# EAGLE design OOBD - BTM182 - V4 (EAGLE 5.11)
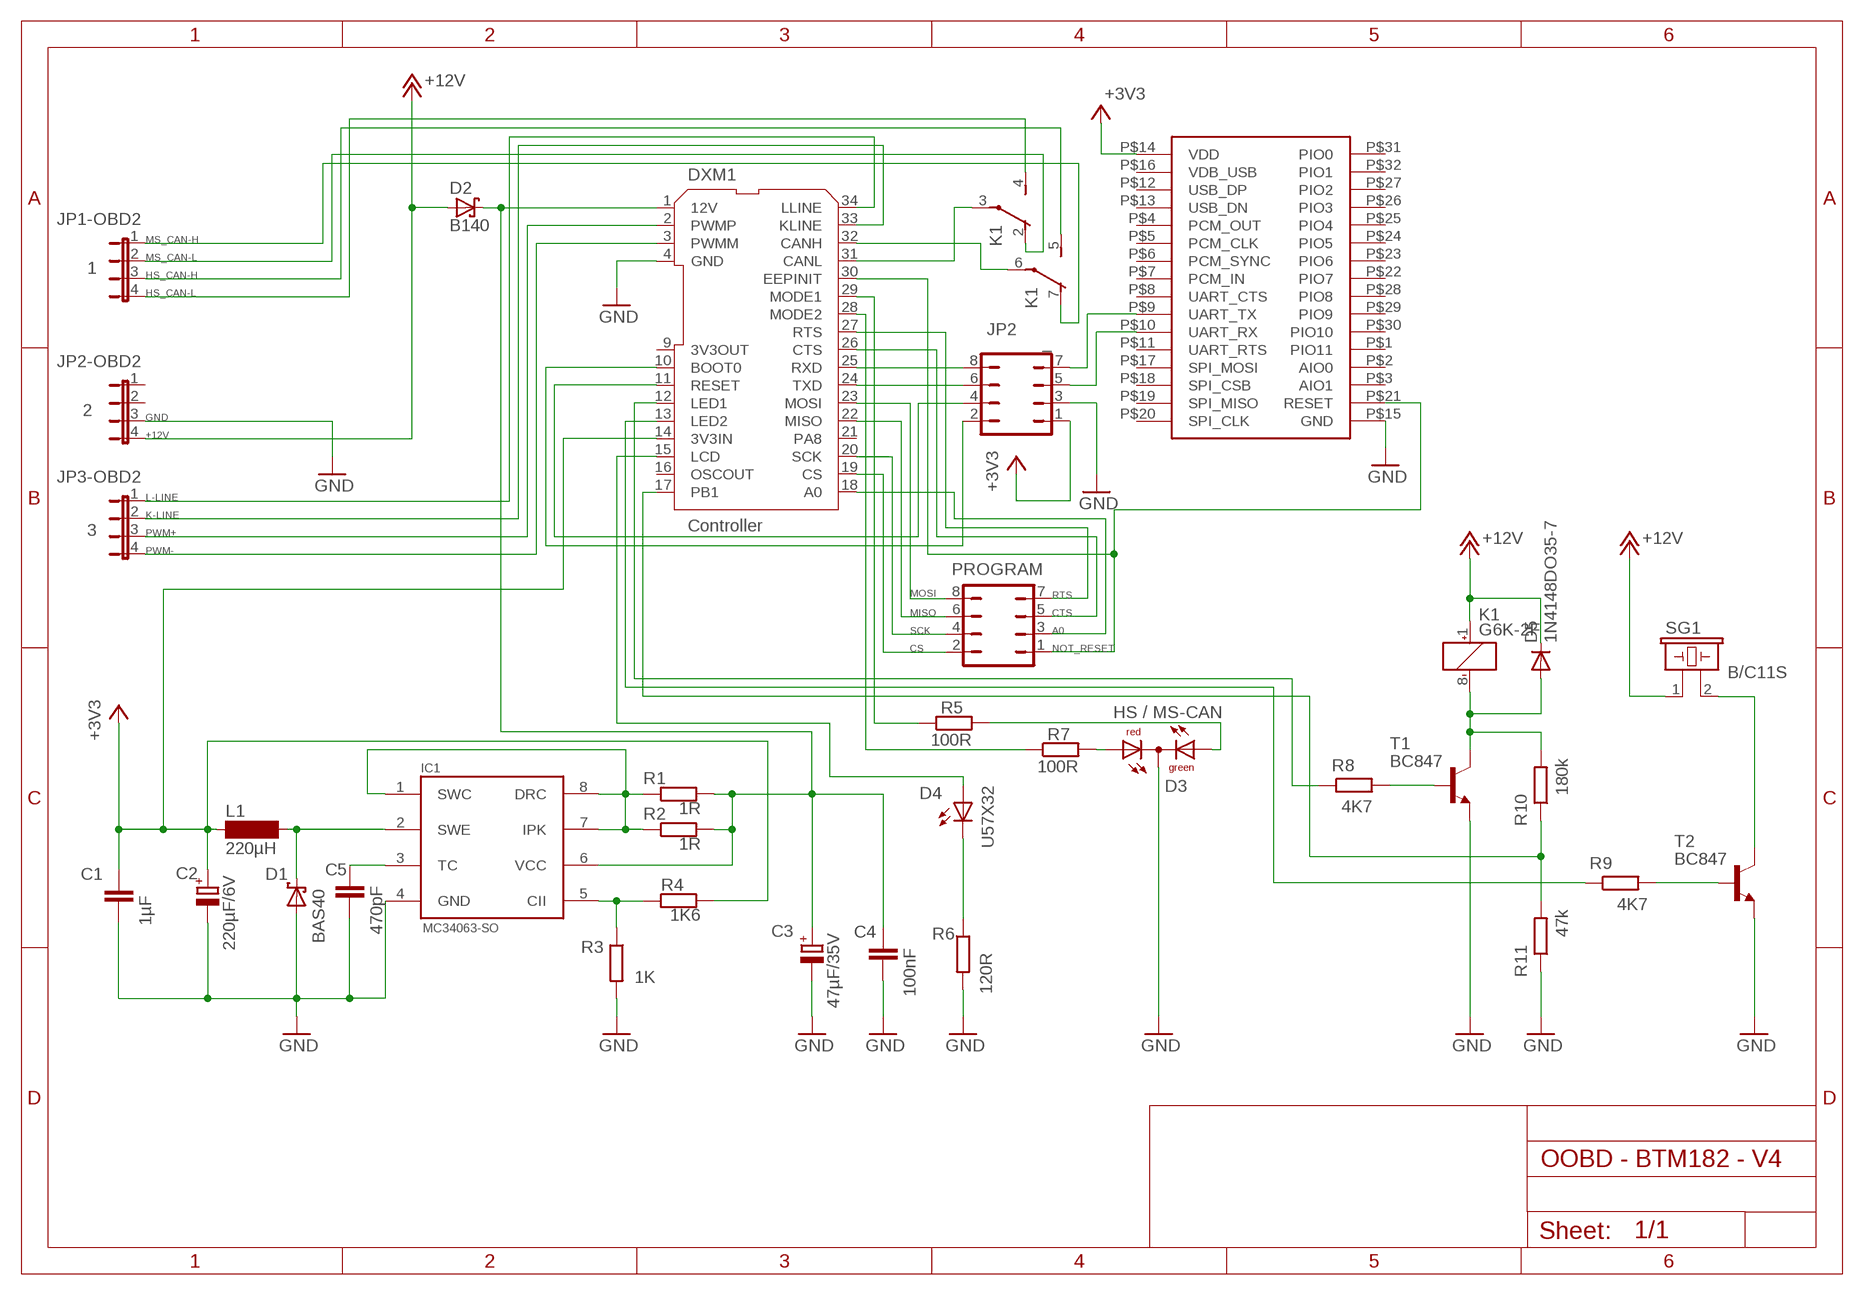
[diagram p0: schematic, sheet 1]

## Parts
BTM182  BT  BTM182  [BTM182]
C1  1µF  C-EUC0603  [C0603]
C2  220µF/6V  CPOL-EUA/3216-18R  [A/3216-18R]
C3  47µF/35V  CPOL-EUA/3216-18R  [A/3216-18R]
C4  100nF  C-EUC0603  [C0603]
C5  470pF  C-EUC0603  [C0603]
D1  BAS40  [SOT23]
D2  B140  SCHOTTKY-DIODESMD  [SMB]
D3  HS / MS-CAN  DUOLED2X5  [DUOLED2X5]
D4  U57X32  LEDSQR5.7X3.2  [U57X32]
D5  1N4148DO35-7  DIODE-MICROMELF-R  [MICROMELF-R]
DXM1  Controller  DXM1-MINI  [DMX1-MINI]
IC1  MC34063-SO  [SO8]
JP1-OBD2  1  JP4E  [JP4]
JP2  _  JP4Q  [JP4Q]
JP2-OBD2  2  JP4E  [JP4]
JP3-OBD2  3  JP4E  [JP4]
K1  G6K-2F  [G6K-2F]
L1  220µH  SM-NE29  [SM-NE29]
PROGRAM  JP4Q  [JP4Q]
R1  1R  R-EU_R0603  [R0603]
R2  1R  R-EU_R0603  [R0603]
R3  1K  R-EU_R0603  [R0603]
R4  1K6  R-EU_R0603  [R0603]
R5  100R  R-EU_R0603  [R0603]
R6  120R  R-EU_R0603  [R0603]
R7  100R  R-EU_R0603  [R0603]
R8  4K7  R-EU_R0603  [R0603]
R9  4K7  R-EU_R0603  [R0603]
R10  180k  R-EU_R0603  [R0603]
R11  47k  R-EU_R0603  [R0603]
SG1  B/C11S  [B/C11S]
T1  BC847  [SOT23]
T2  BC847  [SOT23]

## Nets
+3V3: BTM182.P$14(VDD) C1.1 C2.+ DXM1.14(3V3IN) JP2.1 L1.1 R4.2
+12V: D2.A D5.C JP2-OBD2.4 K1.1(1:+) SG1.1
A0: DXM1.18(A0) PROGRAM.3
CS: DXM1.19(CS) PROGRAM.2
CTS: DXM1.26(CTS) PROGRAM.5
GND: BTM182.P$15(GND) C1.2 C2.- C3.- C4.2 C5.2 D1.1(A) D3.K(C) DXM1.4(GND) IC1.4(GND) JP2-OBD2.3 JP2.3 R3.2 R6.2 R11.1 T1.2(E) T2.2(E)
HS_CAN-H: JP1-OBD2.3 K1.5(3:S)
HS_CAN-L: JP1-OBD2.4 K1.4(2:S)
K-LINE: DXM1.33(KLINE) JP3-OBD2.2
L-LINE: DXM1.34(LLINE) JP3-OBD2.1
MISO: DXM1.22(MISO) PROGRAM.6
MOSI: DXM1.23(MOSI) PROGRAM.8
MS_CAN-H: JP1-OBD2.1 K1.7(3:O)
MS_CAN-L: JP1-OBD2.2 K1.2(2:O)
N$1: IC1.5(CII) R3.1 R4.1
N$2: C5.1 IC1.3(TC)
N$3: D1.3(C) IC1.2(SWE) L1.2
N$4: D3.AR R7.2
N$5: IC1.1(SWC) IC1.7(IPK) IC1.8(DRC) R1.1 R2.1
N$6: D3.AG R5.2
N$7: D4.K(C) R6.1
N$8: D4.A DXM1.15(LCD)
N$9: DXM1.29(MODE1) R5.1
N$10: DXM1.25(RXD) JP2.8
N$11: C3.+ C4.1 D2.C DXM1.1(12V) IC1.6(VCC) R1.2 R2.2
N$12: DXM1.24(TXD) JP2.6
N$13: BTM182.P$10(UART_RX) JP2.5
N$14: BTM182.P$9(UART_TX) JP2.7
N$15: DXM1.28(MODE2) R7.1
N$16: DXM1.10(BOOT0) JP2.2
N$17: DXM1.11(RESET) JP2.4
N$19: DXM1.17(PB1) R10.1 R11.2
N$20: R8.2 T1.1(B)
N$21: DXM1.32(CANH) K1.6(3:P)
N$22: DXM1.31(CANL) K1.3(2:P)
N$23: SG1.2 T2.3(C)
N$24: R9.2 T2.1(B)
N$25: DXM1.12(LED1) R8.1
N$26: DXM1.13(LED2) R9.1
N$27: D5.A K1.8(1:-) R10.2 T1.3(C)
NOT_RESET: BTM182.P$21(RESET) DXM1.30(EEPINIT) PROGRAM.1
PWM+: DXM1.2(PWMP) JP3-OBD2.3
PWM-: DXM1.3(PWMM) JP3-OBD2.4
RTS: DXM1.27(RTS) PROGRAM.7
SCK: DXM1.20(SCK) PROGRAM.4
Unconnected: BTM182.P$1(PIO11) BTM182.P$2(AIO0) BTM182.P$3(AIO1) BTM182.P$4(PCM_OUT) BTM182.P$5(PCM_CLK) BTM182.P$6(PCM_SYNC) BTM182.P$7(PCM_IN) BTM182.P$8(UART_CTS) BTM182.P$11(UART_RTS) BTM182.P$12(USB_DP) BTM182.P$13(USB_DN) BTM182.P$16(VDB_USB) BTM182.P$17(SPI_MOSI) BTM182.P$18(SPI_CSB) BTM182.P$19(SPI_MISO) BTM182.P$20(SPI_CLK) BTM182.P$22(PIO7) BTM182.P$23(PIO6) BTM182.P$24(PIO5) BTM182.P$25(PIO4) BTM182.P$26(PIO3) BTM182.P$27(PIO2) BTM182.P$28(PIO8) BTM182.P$29(PIO9) BTM182.P$30(PIO10) BTM182.P$31(PIO0) BTM182.P$32(PIO1) DXM1.16(OSCOUT) DXM1.21(PA8) JP2-OBD2.1 JP2-OBD2.2

## Power pins joined to a net without a drawn wire
3V3OUT: DXM1.9(3V3OUT)

## Library data of the parts
BTM182 = BTM182:BTM182
C1 C4 C5 = rcl:C-EU: CAPACITOR, European symbol
C2 C3 = rcl:CPOL-EU: POLARIZED CAPACITOR, European symbol
D1 = diode:BAS40: Silicon Schottky Diodes General-purpose diode for high-speed switching
D2 = diode:SCHOTTKY-DIODE: Schottky Diode
D3 = led:DUOLED2X5: DUO LED 2 colors, 2.5 x 5 mm, recangle
D4 = led:LED: LED OSRAM: - CHIPLED LG R971, LG N971, LY N971, LG Q971, LY Q971, LO R971, LY R971 LH N974, LH R974 LS Q976, LO Q976, LY Q976 LO Q996 - Hyper CHIPLED LW Q18S LB Q993, LB Q99A, LB R99A - SideLED LS A670, LO A670, LY A670, LG A670, LP A670 LB A673, LV A673, LT A673, LW A673 LH A674 LY A675 LS A676, LA A676, LO A676, LY A676, LW A676 LS A679, LY A679, LG A679 - Hyper Micro SIDELED® LS Y876, LA Y876, LO Y876, LY Y876 LT Y87S - SmartLED LW L88C, LW L88S LB L89C, LB L89S, LG L890 LS L89K, LO L89K, LY L89K LS L896, LA L896, LO L896, LY L896 - TOPLED LS T670, LO T670, LY T670, LG T670, LP T670 LSG T670, LSP T670, LSY T670, LOP T670, LYG T670 LG T671, LOG T671, LSG T671 LB T673, LV T673, LT T673, LW T673 LH T674 LS T676, LA T676, LO T676, LY T676, LB T676, LH T676, LSB T676, LW T676 LB T67C, LV T67C, LT T67C, LS T67K, LO T67K, LY T67K, LW E67C LS E67B, LA E67B, LO E67B, LY E67B, LB E67C, LV E67C, LT E67C LW T67C LS T679, LY T679, LG T679 LS T770, LO T770, LY T770, LG T770, LP T770 LB T773, LV T773, LT T773, LW T773 LH T774 LS E675, LA E675, LY E675, LS T675 LS T776, LA T776, LO T776, LY T776, LB T776 LHGB T686 LT T68C, LB T68C - Hyper Mini TOPLED® LB M676 - Mini TOPLED Santana® LG M470 LS M47K, LO M47K, LY M47K Source: http://www.osram.convergy.de LUXEON: - LUMILED® LXK2-PW12-R00, LXK2-PW12-S00, LXK2-PW14-U00, LXK2-PW14-V00 LXK2-PM12-R00, LXK2-PM12-S00, LXK2-PM14-U00 LXK2-PE12-Q00, LXK2-PE12-R00, LXK2-PE12-S00, LXK2-PE14-T00, LXK2-PE14-U00 LXK2-PB12-K00, LXK2-PB12-L00, LXK2-PB12-M00, LXK2-PB14-N00, LXK2-PB14-P00, LXK2-PB14-Q00 LXK2-PR12-L00, LXK2-PR12-M00, LXK2-PR14-Q00, LXK2-PR14-R00 LXK2-PD12-Q00, LXK2-PD12-R00, LXK2-PD12-S00 LXK2-PH12-R00, LXK2-PH12-S00 LXK2-PL12-P00, LXK2-PL12-Q00, LXK2-PL12-R00 Source: www.luxeon.com KINGBRIGHT: KA-3528ASYC Source: www.kingbright.com
D5 = diode:DIODE-: DIODE
DXM1 = DXM:DXM1-MINI
IC1 = mc34063:MC34063-SO: DC/DC converter MC34063 in SO08.
JP1-OBD2 JP2-OBD2 JP3-OBD2 = jumper:JP4E: JUMPER
JP2 PROGRAM = jumper:JP4Q: JUMPER
K1 = relay:G6K: Low Signal Relay oeiwcsnts1.omron.com/.. D20G6K0100.pdf; MF: OMRON COMPONENTS USA; MPN: G6K-2F DC24; OC_FARNELL: 1690427; OC_NEWARK: 36K7467
L1 = inductor-neosid:SM-NE29: INDUCTOR SMD chip inductor; OC_FARNELL: unknown; OC_NEWARK: unknown
R1-R11 = rcl:R-EU_: RESISTOR, European symbol
SG1 = buzzer:B/C11S: BUZZER Source: Buerklin; OC_FARNELL: unknown; OC_NEWARK: unknown
T1 T2 = transistor:BC847: NPN TRANSISTOR

## Board
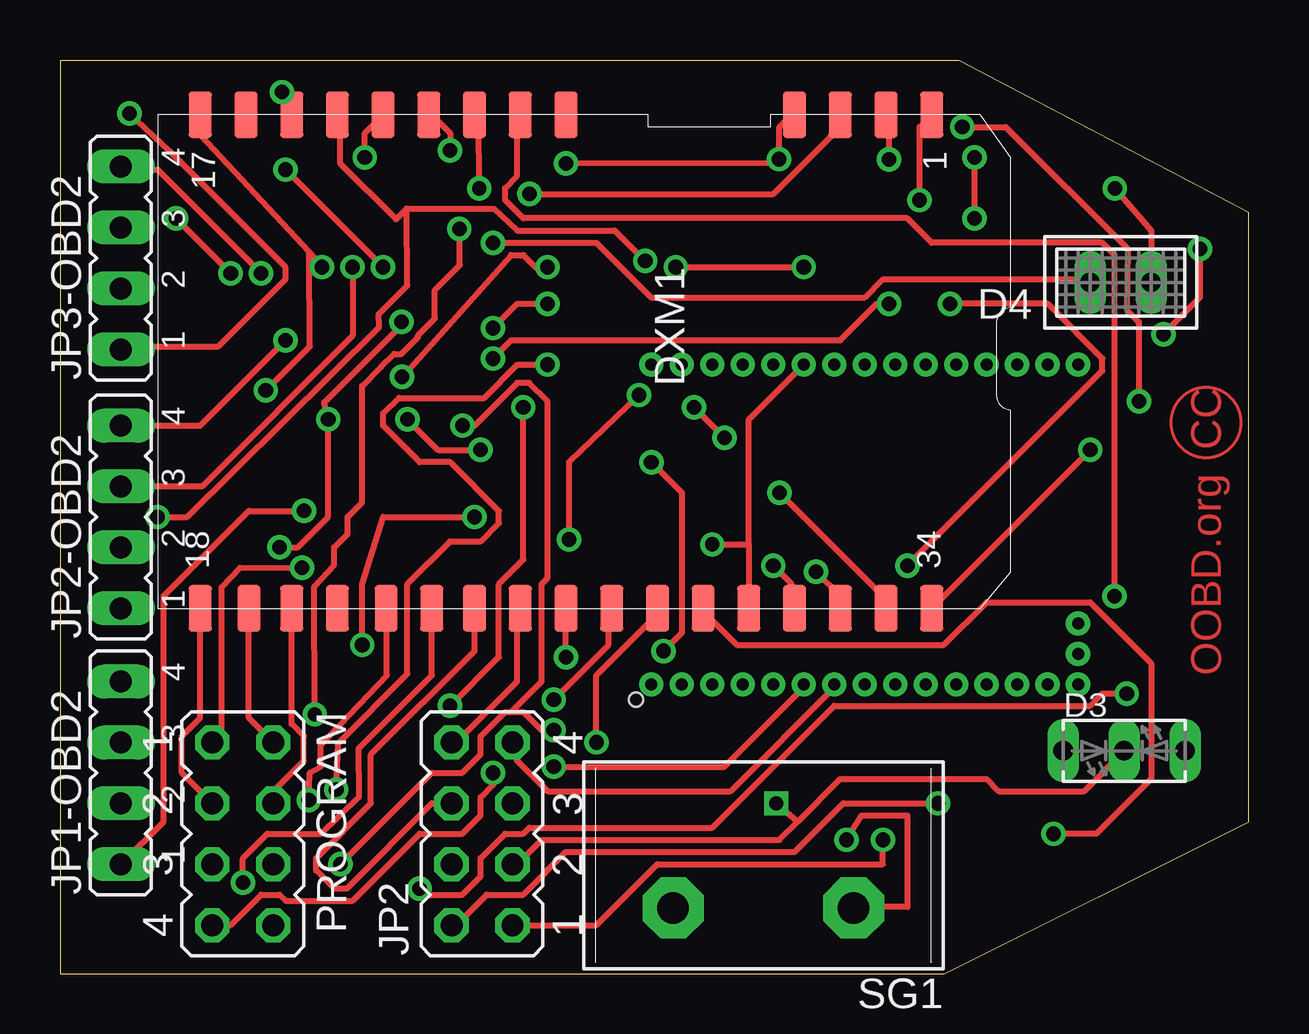
[diagram p1: board, top side]
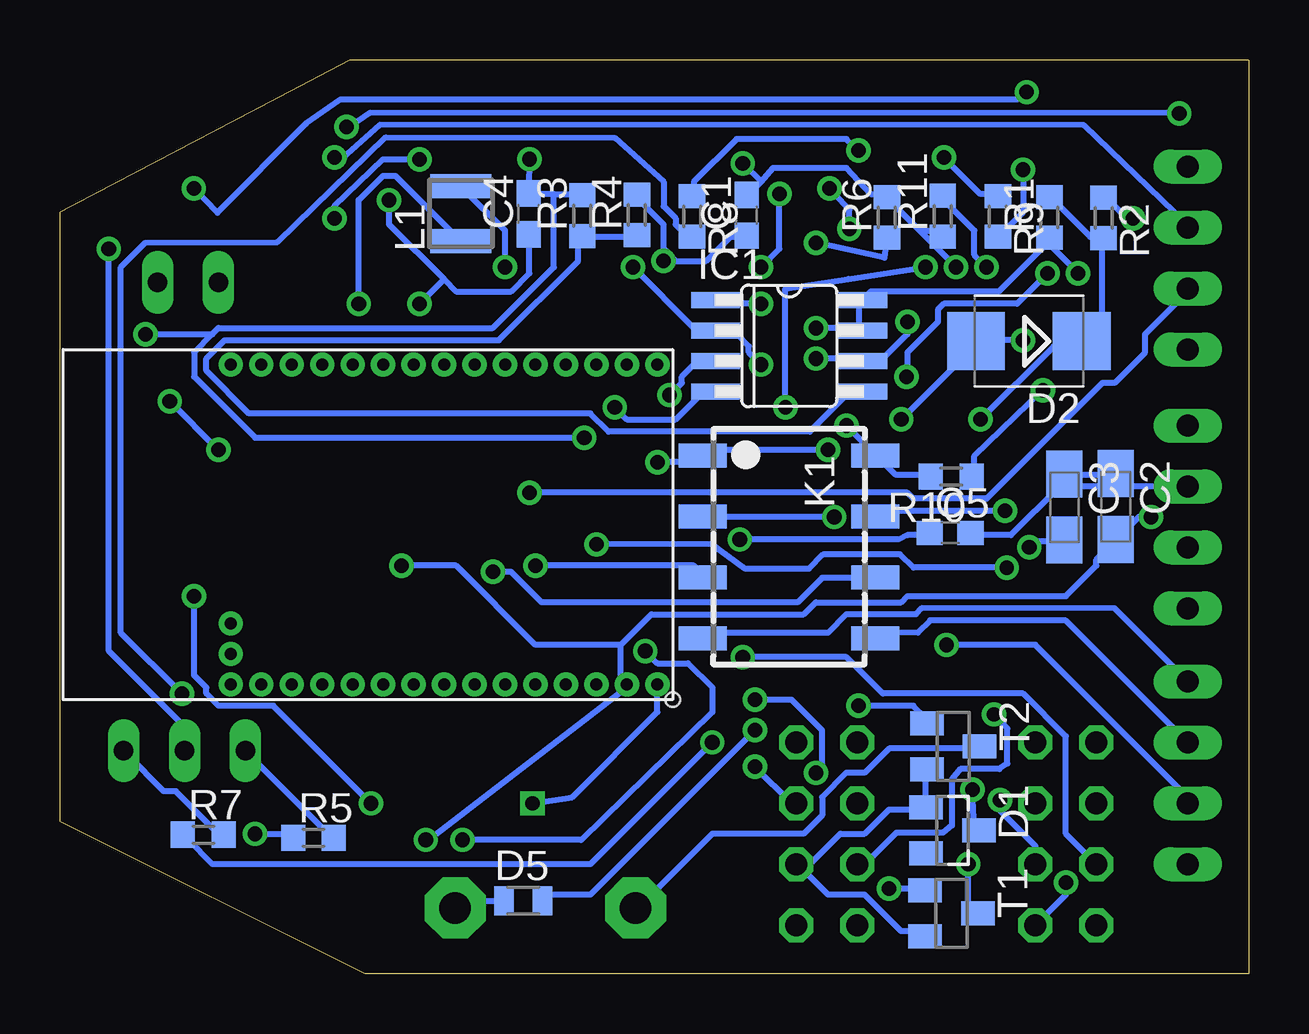
[diagram p2: board, bottom side, seen from below]

Size 49.53 x 38.1 mm. Coordinates in mm from the lower left corner, seen from the top.
Outline: 0,38.09 0,0 36.84,0 49.53,6.35
Outline: 0.01,38.1 37.46,38.1
Outline: 37.46,38.09 49.53,31.75 49.53,6.36
Copper layers (1*16): Top 0.035mm / dielectric 1.5mm / Bottom 0.035mm
Design rules "default *": minimum track width 10mil, minimum drill 24mil, track to track 8mil, track to pad 8mil, pad to pad 8mil, via to via 8mil, smd to smd 8mil, copper to edge 40mil, drill to drill 8mil, minimum pad ring 10mil, minimum via ring 8mil, stop-mask expansion 4mil, vias tented up to drill 0mil, thermal gap 10mil
tRestrict: area 46,12.2 to 49.3,24.5

### Footprints (pad centres in the part's own frame; a part is rotated, then mirrored left to right if it is on the bottom)
BTM182 = drill 0.5 pad 0.813 round: P$1 6.985,-13.97; P$2 8.255,-13.97; P$3 9.525,-13.97; P$4 10.795,-13.97; P$5 12.065,-13.97; P$6 13.335,-13.97; P$7 14.605,-13.97; P$8 15.875,-13.97; P$9 17.145,-13.97; P$10 18.415,-13.97; P$11 19.685,-13.97; P$12 20.955,-13.97; P$13 22.225,-13.97; P$14 23.495,-13.97; P$15 24.765,-13.97; P$16 24.765,-0.635; P$17 23.495,-0.635; P$18 22.225,-0.635; P$19 20.955,-0.635; P$20 19.685,-0.635; P$21 18.415,-0.635; P$22 17.145,-0.635; P$23 15.875,-0.635; P$24 14.605,-0.635; P$25 13.335,-0.635; P$26 12.065,-0.635; P$27 10.795,-0.635; P$28 9.525,-0.635; P$29 8.255,-0.635; P$30 6.985,-0.635; P$31 6.985,-12.7; P$32 6.985,-11.43 | hole 0.6: 25.4,-14.605
C0603 = smd 1.1 x 1: 1 -0.85,0; 2 0.85,0
A/3216-18R = smd 1.95 x 1.5: + 1.375,0; - -1.375,0
SOT23 = smd 1 x 1.4: 1 -0.95,-1.1; 2 0.95,-1.1; 3 0,1.1
SMB = smd 2.4 x 2.4: A 2.2,0; C -2.2,0
DUOLED2X5 = drill 0.813 long: AG -2.54,0; AR 2.54,0; K 0,0
U57X32 = drill 0.813 long: A -1.27,0; K 1.27,0
MICROMELF-R = smd 0.8 x 1.2: A 0.8,0; C -0.8,0
DMX1-MINI = smd 1.93 x 0.965: 1 0,32.258; 2 0,30.353; 3 0,28.448; 4 0,26.543; 9 0,17.018; 10 0,15.113; 11 0,13.208; 12 0,11.303; 13 0,9.398; 14 0,7.493; 15 0,5.588; 16 0,3.683; 17 0,1.778; 18 20.574,1.778; 19 20.574,3.81; 20 20.574,5.588; 21 20.574,7.493; 22 20.574,9.525; 23 20.574,11.43; 24 20.574,13.208; 25 20.574,15.113; 26 20.574,17.018; 27 20.574,18.923; 28 20.574,20.828; 29 20.574,22.733; 30 20.574,24.638; 31 20.574,26.543; 32 20.574,28.448; 33 20.574,30.353; 34 20.574,32.258
SO8 = smd 0.66 x 2.032: 1 -1.905,-3.073; 2 -0.635,-3.073; 3 0.635,-3.073; 4 1.905,-3.073; 5 1.905,3.073; 6 0.635,3.073; 7 -0.635,3.073; 8 -1.905,3.073
JP4 = drill 0.914 long: 1 -3.81,0; 2 -1.27,0; 3 1.27,0; 4 3.81,0
JP4Q = drill 0.914 octagon: 1 -3.81,-1.27; 2 -3.81,1.27; 3 -1.27,-1.27; 4 -1.27,1.27; 5 1.27,-1.27; 6 1.27,1.27; 7 3.81,-1.27; 8 3.81,1.27
G6K-2F = smd 1 x 2: 1 -3.81,-3.6; 2 -1.27,-3.6; 3 1.27,-3.6; 4 3.81,-3.6; 5 3.81,3.6; 6 1.27,3.6; 7 -1.27,3.6; 8 -3.81,3.6
SM-NE29 = smd 1 x 2.54: 1 -1.15,0; 2 1.15,0
R0603 = smd 1 x 1.1: 1 -0.85,0; 2 0.85,0
B/C11S = drill 1.321 pad 2.54 octagon: 1 -3.759,0; 2 3.759,0

### Placement (x,y rotation side)
BTM182  49.4,26.03 0 bottom
C1  20.92,31.63 90 bottom
C2  5.54,19.48 270 bottom
C3  7.68,19.46 270 bottom
C4  30.01,31.68 90 bottom
C5  12.44,18.38 0 bottom
D1  12.35,5.99 270 bottom
D2  9.16,26.38 180 bottom
D3  44.34,9.31 0 top
D4  44.2,28.82 180 top
D5  30.23,3.05 0 bottom
DXM1  4.06,35.81 270 top
IC1  19.15,26.18 270 bottom
JP1-OBD2  2.54,8.38 90 top
JP2  17.58,5.84 90 top
JP2-OBD2  2.54,19.05 90 top
JP3-OBD2  2.54,29.84 90 top
K1  19.15,17.81 270 bottom
L1  32.83,31.7 90 bottom
PROGRAM  7.62,5.84 270 top
R1  8.31,31.54 90 bottom
R2  6.05,31.51 270 bottom
R3  27.77,31.61 90 bottom
R4  25.49,31.64 90 bottom
R5  38.96,5.67 0 bottom
R6  15.08,31.54 90 bottom
R7  43.56,5.8 0 bottom
R8  23.19,31.58 270 bottom
R9  10.45,31.58 270 bottom
R10  12.39,20.74 180 bottom
R11  12.75,31.59 90 bottom
SG1  29.31,2.75 180 top
T1  12.38,2.53 270 bottom
T2  12.31,9.49 270 bottom

### Tracks (layer width: path | path; a pad name or v marks a point on that pad's centre or on a via)
+3V3  (via drill 0.61)
  Top 0.254: 14.45,31.91 18.08,31.89 19.05,30.99 23.11,30.99 v24.38,29.72 | 14.45,31.91 14,31.46 11.68,33.78 11.68,35.81 DXM1.14 | v37.08,27.94 41.15,27.94 43.43,25.65 43.43,25.15 v35.31,17.02 | v34.29,5.59 34.29,4.57 24.89,4.57 22.35,2.03 JP2.1 | 14.45,31.91 14.48,28.7 13.27,27.5 13.3,26.97 5.3,19.05 v4.06,19.05
  Bottom 0.254: 24.13,29.97 24.38,30.23 24.38,31.24 25.4,32.26 R4.2 | 24.13,29.97 23.88,29.72 22.61,29.72 21.59,30.73 21.08,30.73 C1.1 | v24.38,29.72 24.13,29.97 | 26.16,13.72 24.89,14.99 18.54,14.99 18.03,15.49 14.48,15.49 14.22,15.75 7.62,15.75 6.35,17.02 6.35,17.27 5.59,18.03 C2.+ 5.33,18.29 4.57,19.05 v4.06,19.05 | 26.16,13.72 26.16,12.45 25.91,12.19 BTM182.P$14 25.91,11.94 34.16,5.59 v34.29,5.59 | v37.08,27.94 37.08,32.26 36.07,33.27 35.56,33.27 33.02,30.73 L1.1 | v35.31,17.02 33.02,17.02 29.72,13.72 26.16,13.72
+12V  (via drill 0.61)
  Top 0.254: v17.53,21.84 15.75,21.84 v14.48,23.11 | JP2-OBD2.4 5.84,22.86 v9.4,26.42 | v32.77,5.59 33.4,6.6 35.31,6.6 35.31,2.79 33.02,2.79 SG1.1 | v25.15,13.46 25.91,14.22 25.91,20.07 v24.64,21.34
  Bottom 0.254: D5.C 31.24,3.05 32.77,3.05 33.02,2.79 SG1.1 | v17.53,21.84 22.61,21.84 K1.1 22.86,21.59 23.11,21.34 v24.64,21.34 | v14.48,23.11 11.43,26.16 D2.A 11.18,26.42 v9.4,26.42 | v32.77,5.59 27.81,5.59 22.35,10.92 22.35,11.94 23.37,12.95 24.64,12.95 v25.15,13.46
A0
  Top 0.254: DXM1.18 5.84,10.67 5.08,9.91 5.08,8.38 PROGRAM.3
CS
  Top 0.254: DXM1.19 7.87,10.67 PROGRAM.2
CTS  (via drill 0.61)
  Top 0.254: v21.08,13.21 DXM1.26
  Bottom 0.254: v21.08,13.21 16.76,13.21 15.24,11.68 9.4,11.68 7.62,9.91 7.62,5.84 PROGRAM.5
GND  (via drill 0.6, 0.61)
  Top 0.254: 30.73,6.35 29.97,5.59 20.07,5.59 19.05,4.57 JP2.3 | D3.K 44.2,9.14 42.67,7.62 39.12,7.62 38.61,8.13 32.51,8.13 30.73,6.35 | DXM1.4 30.48,35.81 29.97,35.31 v29.96,33.96 29.6,33.79 v21.08,33.78 | v27.69,22.35 v26.42,23.62 | JP2-OBD2.3 5.92,20.32 12.19,26.62 v12.19,29.46 | v47.5,30.23 47.5,28.19 v45.97,26.67 | 30.73,6.35 v29.84,7.11
  Bottom 0.254: T2.2 13.46,8.38 13.46,7.11 D1.1 13.46,6.86 14.99,6.86 16,5.84 17.02,5.84 18.54,4.32 | 18.54,4.32 18.8,4.57 JP2.3 18.54,4.32 | 18.54,4.32 17.53,3.3 16,3.3 14.48,1.78 13.72,1.78 T1.2 | 7.87,20.32 9.91,18.29 11.43,18.29 C5.2 | 7.87,20.32 7.87,20.83 C3.- | C2.- 5.59,20.83 7.62,20.83 C3.- | JP2-OBD2.3 7.87,20.32 | 7.87,20.32 C3.- | 13.72,30.99 12.95,30.99 R11.1 | 13.72,30.99 14.99,32.26 R6.2 15.24,32.51 15.75,32.51 16.76,33.61 19.81,33.61 20.32,33.02 | 20.32,33.02 20.83,32.51 C1.2 | 28.96,32.51 29.97,32.51 C4.2 29.97,32.77 v29.96,33.96 | 28.96,32.51 27.94,32.51 R3.2 | v26.42,23.62 25.91,23.11 23.88,23.11 22.86,24.13 22.35,24.13 IC1.4 | v27.69,22.35 41.4,22.35 43.94,24.89 43.94,25.91 43.18,26.67 | 43.18,26.67 42.93,26.92 31.5,26.92 28.96,29.46 28.96,32.51 | v21.08,33.78 20.32,33.02 | 13.72,30.99 v12.19,29.46 | v47.5,30.23 47.5,13.46 44.45,10.41 44.45,9.4 D3.K | v45.97,26.67 43.18,26.67 | v29.84,7.11 28.19,7.37 24.64,10.92 BTM182.P$15
HS_CAN-H
  Bottom 0.254: JP1-OBD2.3 7.62,14.73 13.27,14.74 13.78,14.23 15.49,14.22 K1.5
HS_CAN-L
  Bottom 0.254: JP1-OBD2.4 5.59,15.24 13.61,15.25 13.87,14.99 16.76,14.99 17.53,14.22 22.61,14.22 K1.4
K-LINE  (via drill 0.61)
  Top 0.254: v29.97,20.07 34.29,15.75 34.29,15.24 DXM1.33
  Bottom 0.254: v29.97,20.07 14.22,20.07 13.97,19.81 10.92,19.81 6.1,24.64 5.59,24.64 4.32,25.91 4.32,26.67 2.54,28.45 JP3-OBD2.2
L-LINE  (via drill 0.61)
  Top 0.254: v42.93,21.84 DXM1.34 | v44.96,23.88 44.96,27.18 44.45,27.69 44.48,30.23 39.41,35.31 v37.59,35.31 | v2.89,35.88 4.57,34.29 9.4,29.46 9.4,28.96 6.6,26.16 2.54,26.16 JP3-OBD2.1
  Bottom 0.254: v44.96,23.88 v42.93,21.84 | v37.59,35.31 37.41,35.34 36.61,35.9 v2.89,35.88
MISO  (via drill 0.61)
  Top 0.254: v10.37,7.24 10.41,8.38 10.86,8.64 10.86,9.55 13.62,12.45 13.61,15.22 DXM1.22
  Bottom 0.254: v10.37,7.24 10.41,6.86 8.89,5.33 PROGRAM.6
MOSI  (via drill 0.61)
  Top 0.254: DXM1.23 15.49,12.45 12.45,9.4 12.46,7.38 10.89,5.84 8.64,5.84 7.62,4.83 v7.62,3.81
  Bottom 0.254: v7.62,3.81 7.62,3.3 PROGRAM.8
MS_CAN-H  (via drill 0.61)
  Top 0.254: v10.16,19.3 7.87,19.3 4.32,15.75 4.32,6.35 JP1-OBD2.1
  Bottom 0.254: v10.16,19.3 15.49,19.3 K1.7
MS_CAN-L  (via drill 0.61)
  Top 0.254: v17.27,19.05 13.46,19.05 12.59,16.26 v12.59,13.72
  Bottom 0.254: v17.27,19.05 22.61,19.05 K1.2 | v12.59,13.72 8.89,13.72 2.54,7.37 JP1-OBD2.2
N$1
  Bottom 0.254: R4.1 25.65,30.73 27.69,30.73 R3.1 27.94,30.73 27.94,29.72 31.24,26.42 42.67,26.42 43.43,25.65 43.43,25.15 41.66,23.37 27.43,23.37 26.67,22.61 18.29,22.61 16.76,24.13 16.26,24.13 IC1.5
N$2  (via drill 0.61)
  Top 0.254: v21.21,18.11 21.21,21.34 v24.13,24.13
  Bottom 0.254: v21.21,18.11 14.59,18.12 14.22,18.29 13.46,18.29 C5.1 | v24.13,24.13 23.62,24.64 23.62,24.89 23.11,25.4 22.35,25.4 IC1.3
N$3  (via drill 0.61)
  Top 0.254: v11.51,7.68 11.59,9.6 14.48,12.51 14.48,16.26 16.26,18.03 17.53,18.03 18.29,18.8 18.29,19.3 16.26,21.34 14.99,21.34 13.46,22.86 13.46,23.37 14.13,24.01 17.69,24.01 19.05,25.4 v20.32,25.4 | v25.65,29.46 v30.99,29.46
  Bottom 0.254: v11.51,7.68 11.43,6.1 D1.3 | v20.32,25.4 20.83,25.91 20.83,26.16 21.34,26.67 22.1,26.67 IC1.2 22.35,26.92 23.11,26.92 v25.65,29.46 | v30.99,29.46 30.99,30.99 32.77,32.77 L1.2
N$4
  Bottom 0.254: R7.2 42.93,5.84 44.7,7.62 45.21,7.62 46.74,9.14 D3.AR
N$5  (via drill 0.61)
  Top 0.254: v4.83,31.5 v7.11,29.21 | v20.32,27.94 19.05,27.94 v18.03,26.92
  Bottom 0.254: 8.38,30.48 10.41,28.45 15.75,28.45 16,28.19 IC1.8 16.26,27.94 16.26,26.92 | v4.83,31.5 5.08,31.5 5.84,32.26 R2.1 | v7.11,29.21 8.38,30.48 | 8.38,30.48 R1.1 | v20.32,27.94 22.1,27.94 IC1.1 | 16.26,26.92 v18.03,26.92 | 16.26,26.92 IC1.7
N$6
  Bottom 0.254: R5.2 38.35,5.84 41.66,9.14 D3.AG
N$7  (via drill 0.61)
  Top 0.254: v18.03,30.48 22.35,30.48 24.64,28.19 33.53,28.19 34.29,28.96 42.93,28.96 D4.K
  Bottom 0.254: v18.03,30.48 15.18,29.86 R6.1
N$8  (via drill 0.6)
  Top 0.254: D4.A 45.47,30.99 v43.95,32.75 | DXM1.15 9.63,35.84 9.59,36.47 9.25,36.71 v9.25,36.76
  Bottom 0.254: v43.95,32.75 42.97,31.73 39.29,35.43 37.85,36.45 9.65,36.45 v9.25,36.76
N$9  (via drill 0.61)
  Top 0.254: v41.4,5.84 43.18,5.84 45.47,8.13 45.47,12.95 42.93,15.49 38.61,15.49 36.83,13.72 28.19,13.72 26.67,15.24 DXM1.29
  Bottom 0.254: v41.4,5.84 39.88,5.84 R5.1
N$10
  Top 0.254: DXM1.25 19.05,15.24 19.05,12.19 16.51,9.65 JP2.8
N$11  (via drill 0.61)
  Top 0.254: v35.81,32.26 35.81,35.31 DXM1.1 | v9.14,17.78 9.91,17.78 11.18,19.05 v11.18,23.11 11,23.82 14.05,26.87 v14.22,27.18 | v34.54,27.94 34.04,27.94 32.51,26.42 18.8,26.42 v18.03,25.65
  Bottom 0.254: 33.53,28.96 35.81,31.24 v35.81,32.26 | 33.53,28.96 33.02,28.45 30.73,28.45 29.97,29.21 29.97,30.73 C4.1 | R1.2 8.13,32.26 6.6,30.73 6.1,30.73 R2.2 6.1,30.48 6.1,27.18 6.86,26.42 D2.C 7.11,26.16 8.13,26.16 v11.18,23.11 | v9.14,17.78 8.89,18.03 7.87,18.03 C3.+ | v14.22,27.18 14.22,26.67 15.24,25.65 16,25.65 IC1.6 16.26,25.65 v18.03,25.65 | v34.54,27.94 33.53,28.96
N$12
  Top 0.254: DXM1.24 17.27,13.46 12.95,9.14 12.95,7.11 10.67,4.83 10.67,4.32 11.43,3.56 11.94,3.56 15.49,7.11 JP2.6
N$13  (via drill 0.61)
  Top 0.254: v20.57,8.64 27.69,8.64 30.99,11.94 BTM182.P$10
  Bottom 0.254: v20.57,8.64 19.05,7.11 JP2.5
N$14
  Top 0.254: BTM182.P$9 32.26,11.94 27.94,7.62 20.32,7.62 19.05,8.89 19.05,9.65 JP2.7
N$15  (via drill 0.61)
  Top 0.254: v22.35,9.65 22.35,12.45 24.89,14.99 DXM1.28
  Bottom 0.254: v22.35,9.65 27.43,4.57 43.18,4.57 44.2,5.59 R7.1
N$16  (via drill 0.61)
  Top 0.254: v43.94,15.75 43.94,29.97 43.43,30.48 36.32,30.48 35.31,31.5 19.3,31.5 18.54,32.26 18.54,32.77 19.05,33.27 19.05,35.81 DXM1.10 | v36.58,7.11 32.64,7.11 30.61,5.08 21.08,5.08 19.3,3.3 17.78,3.3 16.51,2.03 JP2.2
  Bottom 0.254: v43.94,15.75 43.94,12.45 43.43,11.94 43.43,11.68 42.93,11.18 40.64,11.18 v36.58,7.11
N$17  (via drill 0.6)
  Top 0.254: v10.62,10.82 10.6,16.16 11.43,17.05 11.43,17.78 11.98,18.34 11.98,19.06 12.59,19.66 12.59,24.51 13.37,25.29 | 13.37,25.29 | 13.37,25.29 13.92,25.84 14.23,25.84 14.91,26.53 14.91,26.61 15.62,27.32 15.62,28.52 16.66,29.55 16.66,31.04 v16.64,31.06 | v17.47,32.75 17.45,35.63 DXM1.11
  Bottom 0.254: JP2.4 16,4.57 14.69,5.89 12.75,5.89 12.36,6.19 12.36,8.12 12.02,8.54 10.39,8.54 10.06,8.77 10.06,10.23 v10.62,10.82 | v16.64,31.06 16.64,31.84 v17.47,32.75
N$19  (via drill 0.61)
  Top 0.254: v8.57,24.33 8.89,24.64 10.41,26.16 10.39,30.09 | 10.39,30.09 5.87,34.94 DXM1.17 | 10.39,30.09 v10.92,29.46
  Bottom 0.254: v8.57,24.33 11.43,21.59 11.43,20.83 R10.1 | v10.92,29.46 11.43,29.97 11.43,30.99 12.7,32.26 R11.2
N$20  (via drill 0.61)
  Top 0.254: v44.45,11.68 43.43,11.68 42.93,11.18 32.26,11.18 27.18,6.1 19.56,6.1 19.3,5.84 18.54,5.84 17.53,4.83 17.53,4.06 16.76,3.3 15.24,3.3 v14.99,3.56
  Bottom 0.254: v44.45,11.68 46.99,14.22 46.99,29.46 45.97,30.48 40.47,30.51 35.95,34.87 26.42,34.85 24.38,33.02 24.38,32 23.88,31.5 23.88,31.24 23.37,30.73 R8.2 | v14.99,3.56 13.72,3.56 T1.1
N$21  (via drill 0.61)
  Top 0.254: DXM1.32 32.51,15.75 v31.5,16.76
  Bottom 0.254: v31.5,16.76 30.73,16.76 29.46,15.49 18.8,15.49 17.78,16.51 15.75,16.51 K1.6
N$22  (via drill 0.61)
  Top 0.254: v29.72,17.02 30.48,16.26 30.48,15.24 DXM1.31
  Bottom 0.254: v29.72,17.02 23.11,17.02 22.86,16.76 K1.3
N$23
  Bottom 0.254: T2.3 11.43,9.4 14.99,9.4 16,8.38 16.76,8.38 17.78,7.37 17.78,6.6 18.54,5.84 22.35,5.84 25.4,2.79 SG1.2
N$24  (via drill 0.61)
  Top 0.254: v13.46,29.46 v9.4,33.53 | v19.3,23.62 19.3,17.27 18.29,16.26 18.29,13.21 v16.26,11.18
  Bottom 0.254: v9.4,33.53 9.4,31.75 10.41,30.73 R9.2 | v13.46,29.46 16.68,28.97 19.3,28.56 v19.3,23.62 | v16.26,11.18 13.97,11.18 13.46,10.67 T2.1
N$25  (via drill 0.61)
  Top 0.254: v16.26,34.32 16.26,35.05 15.49,35.81 DXM1.12
  Bottom 0.254: v16.26,34.32 16.76,34.8 21.34,34.8 23.11,33.02 23.11,32.51 R8.1
N$26  (via drill 0.61)
  Top 0.254: v12.7,34.04 12.7,35.05 DXM1.13
  Bottom 0.254: v12.7,34.04 11.18,32.51 10.67,32.51 R9.1
N$27  (via drill 0.61)
  Top 0.254: v20.57,10.16 20.07,10.16 19.3,10.92 18.8,10.92 | 18.8,10.92 18.54,10.92 17.53,9.91 17.53,9.14 16.76,8.38 15.49,8.38 v11.68,4.57 | v16.76,22.86 17.27,22.86 19.05,24.64 19.56,24.64 20.32,23.88 20.32,16.51 20.07,16.26 20.07,12.19 18.8,10.92
  Bottom 0.254: R10.2 13.46,20.83 14.73,20.83 15.49,21.59 K1.8 15.75,21.84 v16.76,22.86 | v20.57,10.16 27.43,3.3 29.21,3.3 D5.A | v11.68,4.57 11.68,2.79 11.43,2.54 T1.3
NOT_RESET  (via drill 0.6)
  Top 0.254: 28.7,17.91 28.7,23.11 BTM182.P$21 | 28.7,17.91 DXM1.30 | v27.18,17.91 28.7,17.91 | v10.08,16.93 7.49,16.93 6.73,16.13 6.73,10.03 PROGRAM.1
  Bottom 0.254: v27.18,17.91 22.39,17.92 20.97,16.88 18.32,16.89 17.75,17.48 14.53,17.49 13.96,16.93 v10.08,16.93
PWM+  (via drill 0.61)
  Top 0.254: v34.54,33.96 34.54,35.81 DXM1.2 | v38.1,34.04 v38.1,31.5
  Bottom 0.254: v34.54,33.96 36.07,33.96 38.1,32 v38.1,31.5 | v38.1,34.04 37.98,33.82 36.2,35.4 6.86,35.37 2.54,31.24 JP3-OBD2.3
PWM-  (via drill 0.61)
  Top 0.254: DXM1.3 32.51,35.31 29.72,32.51 v19.56,32.51 | v20.32,29.46 19.81,29.46 19.3,29.97 18.8,29.97 v14.25,24.89 | v8.38,29.21 4.06,33.53 2.54,33.53 JP3-OBD2.4
  Bottom 0.254: v19.56,32.51 19.56,30.23 v20.32,29.46 | v14.25,24.89 14.22,25.91 12.95,27.18 12.95,27.69 12.7,27.94 9.65,27.94 v8.38,29.21
RTS  (via drill 0.61)
  Top 0.254: v20.57,11.43 22.86,13.72 22.86,15.24 DXM1.27 | v18.03,8.38 18.03,7.87 17.53,7.37 17.53,6.6 16.76,5.84 14.99,5.84 12.19,3.05 9.4,3.05 9.14,3.3 8.38,3.3 7.11,2.03 PROGRAM.7
  Bottom 0.254: v20.57,11.43 19.05,11.43 17.78,10.16 17.78,8.64 v18.03,8.38
SCK
  Top 0.254: DXM1.20 9.65,10.41 10.16,9.91 10.16,8.89 8.89,7.62 PROGRAM.4
(copper drawn outside any net)
  shapes: Top circle x1

### Text on the board
Top: OOBD.org CC